# Altium schematic sheet FPGA.SchDoc: FPGA
size A4; CompanyName: WiSE Lab; Engineer: Anh Luong; Organization: Carnegie Mellon University; Address1: 4720 Forbes Ave; Address2: CIC 2219F; Address3: Pittsburgh, PA 15213; Address4: USA; Revision: 1; SheetNumber: 2; SheetTotal: 4
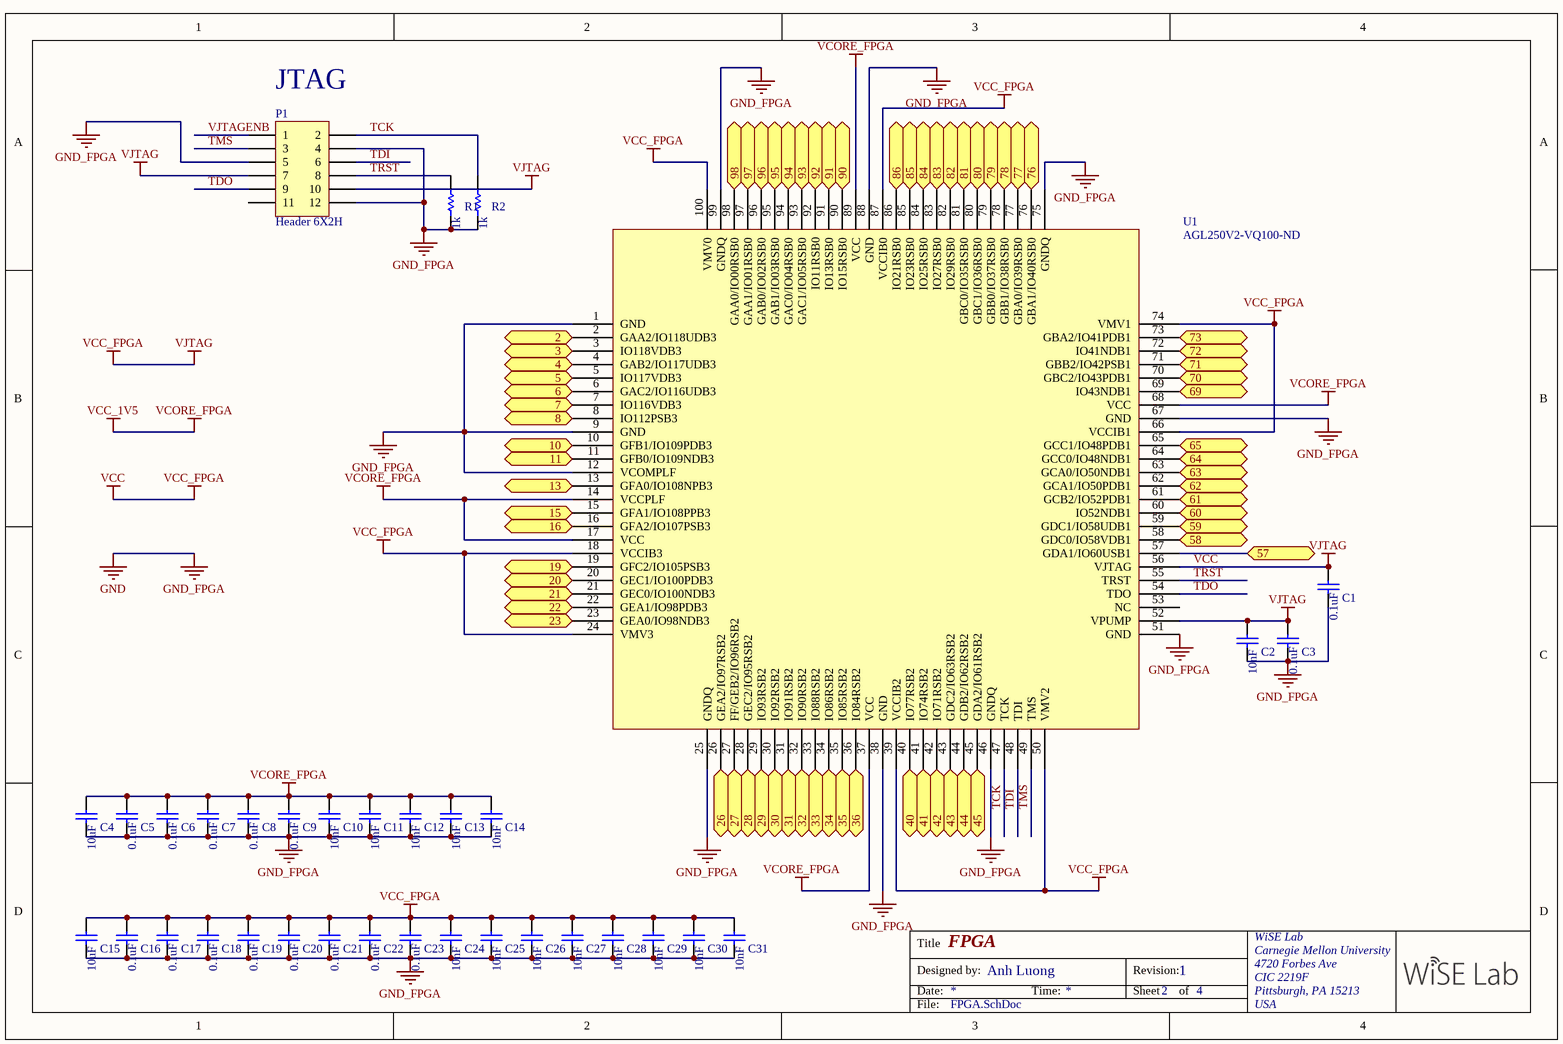
[diagram p0: FPGA.SchDoc]

## Parts
C1  GRM155R71C104KA88D  [CAPC1005X04L]  (value not drawn)
C2  GRM155R71E103KA01D  [CAPC1005X04L]  (value not drawn)
C3  GRM155R71C104KA88D  [CAPC1005X04L]  (value not drawn)
C4  GRM155R60J106ME15D  [INDC1005X04L]  (value not drawn)
C5  GRM155R71C104KA88D  [CAPC1005X04L]  (value not drawn)
C6  GRM155R71C104KA88D  [CAPC1005X04L]  (value not drawn)
C7  GRM155R71C104KA88D  [CAPC1005X04L]  (value not drawn)
C8  GRM155R71C104KA88D  [CAPC1005X04L]  (value not drawn)
C9  GRM155R71C104KA88D  [CAPC1005X04L]  (value not drawn)
C10  GRM155R71E103KA01D  [CAPC1005X04L]  (value not drawn)
C11  GRM155R71E103KA01D  [CAPC1005X04L]  (value not drawn)
C12  GRM155R71E103KA01D  [CAPC1005X04L]  (value not drawn)
C13  GRM155R71E103KA01D  [CAPC1005X04L]  (value not drawn)
C14  GRM155R71E103KA01D  [CAPC1005X04L]  (value not drawn)
C15  GRM155R60J106ME15D  [INDC1005X04L]  (value not drawn)
C16  GRM155R71C104KA88D  [CAPC1005X04L]  (value not drawn)
C17  GRM155R71C104KA88D  [CAPC1005X04L]  (value not drawn)
C18  GRM155R71C104KA88D  [CAPC1005X04L]  (value not drawn)
C19  GRM155R71C104KA88D  [CAPC1005X04L]  (value not drawn)
C20  GRM155R71C104KA88D  [CAPC1005X04L]  (value not drawn)
C21  GRM155R71C104KA88D  [CAPC1005X04L]  (value not drawn)
C22  GRM155R71C104KA88D  [CAPC1005X04L]  (value not drawn)
C23  GRM155R71C104KA88D  [CAPC1005X04L]  (value not drawn)
C24  GRM155R71E103KA01D  [CAPC1005X04L]  (value not drawn)
C25  GRM155R71E103KA01D  [CAPC1005X04L]  (value not drawn)
C26  GRM155R71E103KA01D  [CAPC1005X04L]  (value not drawn)
C27  GRM155R71E103KA01D  [CAPC1005X04L]  (value not drawn)
C28  GRM155R71E103KA01D  [CAPC1005X04L]  (value not drawn)
C29  GRM155R71E103KA01D  [CAPC1005X04L]  (value not drawn)
C30  GRM155R71E103KA01D  [CAPC1005X04L]  (value not drawn)
C31  GRM155R71E103KA01D  [CAPC1005X04L]  (value not drawn)
P1  Header 6X2H  [HDR2X6H]
R1  MCR01MRTF1001  [RESC1005X04N]  (value not drawn)
R2  MCR01MRTF1001  [RESC1005X04N]  (value not drawn)
U1  Supplier Part Number 1: AGL250V2-VQ100-ND  [TSQFP50P1600X1600X120-100N]  (hidden comment: AGL250V2-VQ100)

## Ports
2, 3, 4, 5, 6, 7, 8, 10, 11, 13, 15, 16, 19, 20, 21, 22, 23, 26, 27, 28, 29, 30, 31, 32, 33, 34, 35, 36, 40, 41, 42, 43, 44, 45, 57, 58, 59, 60, 61, 62, 63, 64, 65, 69, 70, 71, 72, 73, 76, 77, 78, 79, 80, 81, 82, 83, 84, 85, 86, 90, 91, 92, 93, 94, 95, 96, 97, 98

## Nets
GND: C1.1 C2.1 C3.1 C4.1 C5.1 C6.1 C7.1 C8.1 C9.1 C10.1 C11.1 C12.1 C13.1 C14.1 C15.1 C16.1 C17.1 C18.1 C19.1 C20.1 C21.1 C22.1 C23.1 C24.1 C25.1 C26.1 C27.1 C28.1 C29.1 C30.1 C31.1 P1.4 P1.5 P1.12 R1.1 R2.1 U1.1(GND) U1.9(GND) U1.12(VCOMPLF) U1.25(GNDQ) U1.38(GND) U1.46(GNDQ) U1.51(GND) U1.67(GND) U1.75(GNDQ) U1.88(GND) U1.99(GNDQ)  [also labelled GND_FPGA]
VCC: C1.2 C2.2 C3.2 C15.2 C16.2 C17.2 C18.2 C19.2 C20.2 C21.2 C22.2 C23.2 C24.2 C25.2 C26.2 C27.2 C28.2 C29.2 C30.2 C31.2 P1.7 P1.10 U1.18(VCCIB3) U1.24(VMV3) U1.39(VCCIB2) U1.50(VMV2) U1.52(VPUMP) U1.56(VJTAG) U1.66(VCCIB1) U1.74(VMV1) U1.87(VCCIB0) U1.100(VMV0)  [also labelled VCC_FPGA, VJTAG]
VCC_1V5: C4.2 C5.2 C6.2 C7.2 C8.2 C9.2 C10.2 C11.2 C12.2 C13.2 C14.2 U1.14(VCCPLF) U1.17(VCC) U1.37(VCC) U1.68(VCC) U1.89(VCC)  [also labelled VCORE_FPGA]
2: U1.2(GAA2/IO118UDB3) ; port 2
3: U1.3(IO118VDB3) ; port 3
4: U1.4(GAB2/IO117UDB3) ; port 4
5: U1.5(IO117VDB3) ; port 5
6: U1.6(GAC2/IO116UDB3) ; port 6
7: U1.7(IO116VDB3) ; port 7
8: U1.8(IO112PSB3) ; port 8
10: U1.10(GFB1/IO109PDB3) ; port 10
11: U1.11(GFB0/IO109NDB3) ; port 11
13: U1.13(GFA0/IO108NPB3) ; port 13
15: U1.15(GFA1/IO108PPB3) ; port 15
16: U1.16(GFA2/IO107PSB3) ; port 16
19: U1.19(GFC2/IO105PSB3) ; port 19
20: U1.20(GEC1/IO100PDB3) ; port 20
21: U1.21(GEC0/IO100NDB3) ; port 21
22: U1.22(GEA1/IO98PDB3) ; port 22
23: U1.23(GEA0/IO98NDB3) ; port 23
26: U1.26(GEA2/IO97RSB2) ; port 26
27: U1.27(FF/GEB2/IO96RSB2) ; port 27
28: U1.28(GEC2/IO95RSB2) ; port 28
29: U1.29(IO93RSB2) ; port 29
30: U1.30(IO92RSB2) ; port 30
31: U1.31(IO91RSB2) ; port 31
32: U1.32(IO90RSB2) ; port 32
33: U1.33(IO88RSB2) ; port 33
34: U1.34(IO86RSB2) ; port 34
35: U1.35(IO85RSB2) ; port 35
36: U1.36(IO84RSB2) ; port 36
40: U1.40(IO77RSB2) ; port 40
41: U1.41(IO74RSB2) ; port 41
42: U1.42(IO71RSB2) ; port 42
43: U1.43(GDC2/IO63RSB2) ; port 43
44: U1.44(GDB2/IO62RSB2) ; port 44
45: U1.45(GDA2/IO61RSB2) ; port 45
57: U1.57(GDA1/IO60USB1) ; port 57
58: U1.58(GDC0/IO58VDB1) ; port 58
59: U1.59(GDC1/IO58UDB1) ; port 59
60: U1.60(IO52NDB1) ; port 60
61: U1.61(GCB2/IO52PDB1) ; port 61
62: U1.62(GCA1/IO50PDB1) ; port 62
63: U1.63(GCA0/IO50NDB1) ; port 63
64: U1.64(GCC0/IO48NDB1) ; port 64
65: U1.65(GCC1/IO48PDB1) ; port 65
69: U1.69(IO43NDB1) ; port 69
70: U1.70(GBC2/IO43PDB1) ; port 70
71: U1.71(GBB2/IO42PSB1) ; port 71
72: U1.72(IO41NDB1) ; port 72
73: U1.73(GBA2/IO41PDB1) ; port 73
76: U1.76(GBA1/IO40RSB0) ; port 76
77: U1.77(GBA0/IO39RSB0) ; port 77
78: U1.78(GBB1/IO38RSB0) ; port 78
79: U1.79(GBB0/IO37RSB0) ; port 79
80: U1.80(GBC1/IO36RSB0) ; port 80
81: U1.81(GBC0/IO35RSB0) ; port 81
82: U1.82(IO29RSB0) ; port 82
83: U1.83(IO27RSB0) ; port 83
84: U1.84(IO25RSB0) ; port 84
85: U1.85(IO23RSB0) ; port 85
86: U1.86(IO21RSB0) ; port 86
90: U1.90(IO15RSB0) ; port 90
91: U1.91(IO13RSB0) ; port 91
92: U1.92(IO11RSB0) ; port 92
93: U1.93(GAC1/IO05RSB0) ; port 93
94: U1.94(GAC0/IO04RSB0) ; port 94
95: U1.95(GAB1/IO03RSB0) ; port 95
96: U1.96(GAB0/IO02RSB0) ; port 96
97: U1.97(GAA1/IO01RSB0) ; port 97
98: U1.98(GAA0/IO00RSB0) ; port 98
TCK: P1.2 R2.2 U1.47(TCK)
TDI: P1.6 U1.48(TDI)
TDO: P1.9 U1.54(TDO)
TMS: P1.3 U1.49(TMS)
TRST: P1.8 R1.2 U1.55(TRST)
VJTAGENB: P1.1

Not connected (* = marked no-connect by the designer): P1 11; U1 53(NC)

## Notes on the sheet
- (near P1) JTAG
- Title
- Designed by:
- Date:
- Time:
- Revision:
- Sheet
- of
- File:
- (in symbol GRM155R60J106ME15D) 10uF
- (in symbol GRM155R71C104KA88D) 0.1uF
- (in symbol GRM155R71E103KA01D) 10nF
- (in symbol MCR01MRTF1001) 1k

## Library data of the parts
C1 C3 C5-C9 C16-C23 = GRM155R71C104KA88D: CAP CER 0.1UF 16V X7R 0402; Manufacturer: Murata Electronics North America; Tolerance: ±10%; Supplier 1: Digi-Key; Manufacturer Part Number: GRM155R71C104KA88D; RoHS: RoHS Compliant; Category: Capacitors; Stock 1: 38255872; Pricing 1: 1=0.1, 10=0.014, 100=0.0062, 500=0.00442, 1000=0.00348, 2500=0.00316, 5000=0.00291 (USD); Packaging: Cut Tape (CT); Part Status: Active; Voltage - Rated: 16V; Temperature Coefficient: X7R; Operating Temperature: -55°C ~ 125°C; Features: -; Ratings: -; Applications: General Purpose; Mounting Type: Surface Mount, MLCC; Package / Case: 0402 (1005 Metric); Size / Dimension: 0.039" L x 0.020" W (1.00mm x 0.50mm); Height - Seated (Max): -; Thickness (Max): 0.022" (0.55mm); Lead Spacing: -; Lead Style: -; ComponentLink1URL: http://www.murata.com/~/media/webrenewal/support/library/catalog/products/capacitor/mlcc/c02e.pdf; ComponentLink1Description: http://www.murata.com/~/media/webrenewal/support/library/catalog/products/capacitor/mlcc/c02e.pdf; Supplier Part Number 1: 490-3261-1-ND
C2 C10-C14 C24-C31 = GRM155R71E103KA01D: CAP CER 10000PF 25V X7R 0402; Manufacturer: Murata Electronics North America; Tolerance: ±10%; Supplier 1: Digi-Key; Manufacturer Part Number: GRM155R71E103KA01D; RoHS: RoHS Compliant; Category: Capacitors; Stock 1: 8083248; Pricing 1: 1=0.1, 10=0.013, 100=0.0056, 500=0.004, 1000=0.00315, 2500=0.00286, 5000=0.00263 (USD); Packaging: Cut Tape (CT); Part Status: Active; Voltage - Rated: 25V; Temperature Coefficient: X7R; Operating Temperature: -55°C ~ 125°C; Features: -; Ratings: -; Applications: General Purpose; Mounting Type: Surface Mount, MLCC; Package / Case: 0402 (1005 Metric); Size / Dimension: 0.039" L x 0.020" W (1.00mm x 0.50mm); Height - Seated (Max): -; Thickness (Max): 0.022" (0.55mm); Lead Spacing: -; Lead Style: -; ComponentLink1URL: http://www.murata.com/~/media/webrenewal/support/library/catalog/products/capacitor/mlcc/c02e.pdf; ComponentLink1Description: http://www.murata.com/~/media/webrenewal/support/library/catalog/products/capacitor/mlcc/c02e.pdf; Supplier Part Number 1: 490-1312-1-ND
C4 C15 = GRM155R60J106ME15D: CAP CER 10UF 6.3V X5R 0402; Manufacturer: Murata Electronics North America; Tolerance: ±20%; Supplier 1: Digi-Key; Manufacturer Part Number: GRM155R60J106ME15D; RoHS: RoHS Compliant; Category: Capacitors; Stock 1: 183912; Pricing 1: 1=0.24, 10=0.16, 100=0.0813, 500=0.0556, 1000=0.04918, 2500=0.04704, 5000=0.04277 (USD); Packaging: Cut Tape (CT); Part Status: Active; Voltage - Rated: 6.3V; Temperature Coefficient: X5R; Operating Temperature: -55°C ~ 85°C; Features: Derating Recommended; Ratings: -; Applications: General Purpose; Mounting Type: Surface Mount, MLCC; Package / Case: 0402 (1005 Metric); Size / Dimension: 0.039" L x 0.020" W (1.00mm x 0.50mm); Height - Seated (Max): -; Thickness (Max): 0.026" (0.65mm); Lead Spacing: -; Lead Style: -; ComponentLink1URL: http://www.murata.com/~/media/webrenewal/support/library/catalog/products/capacitor/mlcc/c02e.pdf; ComponentLink1Description: http://www.murata.com/~/media/webrenewal/support/library/catalog/products/capacitor/mlcc/c02e.pdf; Supplier Part Number 1: 490-13238-1-ND
P1 = Header 6X2H: Header, 6-Pin, Dual row, Right Angle; LatestRevisionDate: 17-Jul-2002; LatestRevisionNote: Re-released for DXP Platform.; Publisher: Altium Limited
R1 R2 = MCR01MRTF1001: RES SMD 1K OHM 1% 1/16W 0402; Manufacturer: Rohm Semiconductor; Power (Watts): 0.063W, 1/16W; Temperature Coefficient: ±100ppm/°C; Supplier 1: Digi-Key; Manufacturer Part Number: MCR01MRTF1001; RoHS: RoHS Compliant; Category: Resistors; Stock 1: 157533; Pricing 1: 1=0.1, 10=0.032, 100=0.0132, 1000=0.00593, 2500=0.00515, 5000=0.00425 (USD); Packaging: Cut Tape (CT); Part Status: Discontinued at Digi-Key; Tolerance: ±1%; Composition: Thick Film; Features: -; Operating Temperature: -55°C ~ 155°C; Package / Case: 0402 (1005 Metric); Supplier Device Package: 0402; Size / Dimension: 0.039" L x 0.020" W (1.00mm x 0.50mm); Height - Seated (Max): 0.016" (0.40mm); Failure Rate: -; ComponentLink1URL: http://rohmfs.rohm.com/en/products/databook/datasheet/passive/resistor/chip_resistor/mcr_g.pdf; ComponentLink1Description: http://rohmfs.rohm.com/en/products/databook/datasheet/passive/resistor/chip_resistor/mcr_g.pdf; Supplier Part Number 1: RHM1.00KCDCT-ND
U1 = AGL250V2-VQ100: IC FPGA 68 I/O 100VQFP; Manufacturer: Microsemi SoC; Number of Logic Elements/Cells: 6144; Total RAM Bits: 36864; Number of I/O: 68; Number of Gates: 250000; Voltage - Supply: 1.14 V ~ 1.575 V; Supplier 1: Digi-Key; Manufacturer Part Number: AGL250V2-VQ100; RoHS: RoHS non-compliant; Category: Integrated Circuits (ICs); Stock 1: 0; Pricing 1: 90=21.59 (USD); Number of LABs/CLBs: -; Mounting Type: Surface Mount; Operating Temperature: 0°C ~ 70°C; Package / Case: 100-TQFP; Supplier Device Package: 100-VQFP (14x14); ComponentLink1URL: http://www.microsemi.com/document-portal/doc_download/130694-igloo-low-power-flash-fpgas-datasheet; ComponentLink1Description: http://www.microsemi.com/document-portal/doc_download/130694-igloo-low-power-flash-fpgas-datasheet